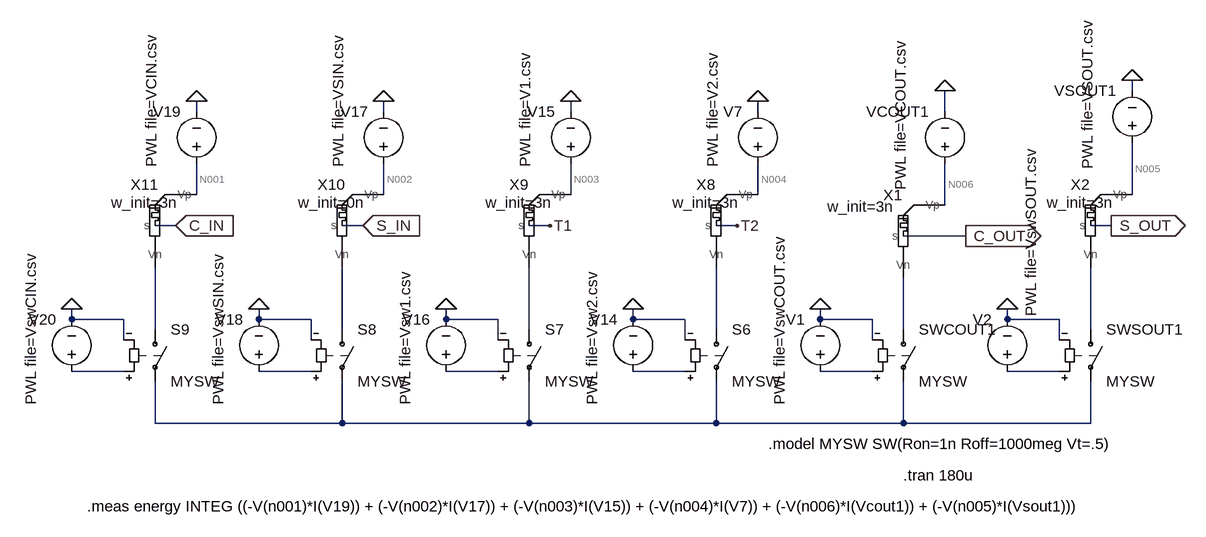
[diagram p0: schematic approx1_PPU.asc]
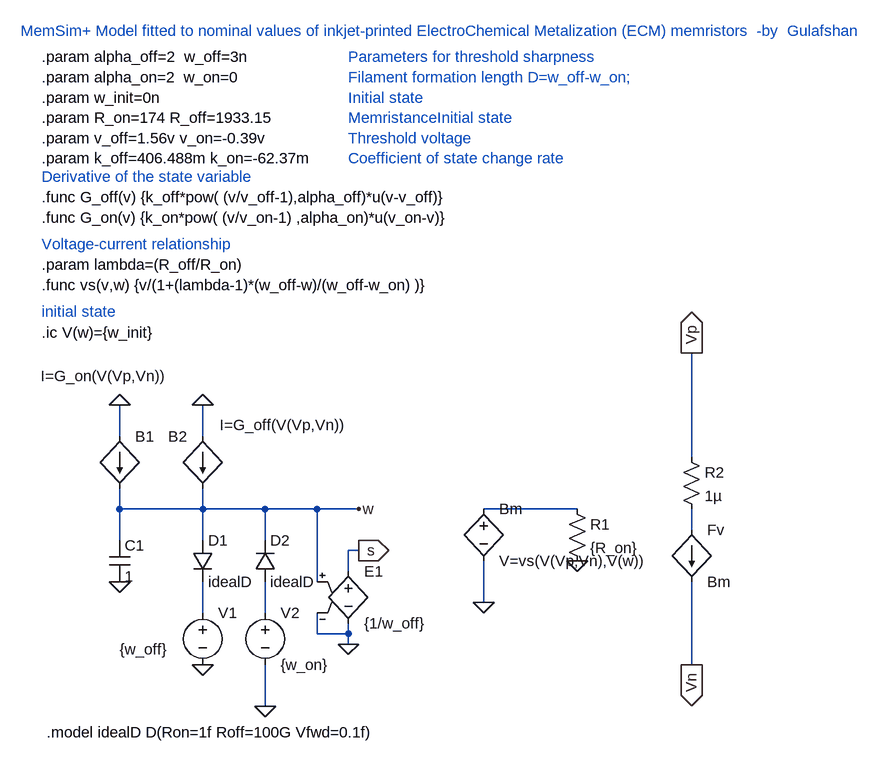
[diagram p1: sub-circuit memsim+ecm_nominal.asc]
approx1_PPU.asc, the LTspice schematic file:
Version 4
SHEET 1 3080 680
WIRE 336 -16 336 -32
WIRE -1104 16 -1104 0
WIRE -816 16 -816 0
WIRE -528 16 -528 0
WIRE -240 16 -240 0
WIRE 48 16 48 -16
WIRE -1104 144 -1104 96
WIRE -816 144 -816 96
WIRE -528 144 -528 96
WIRE -240 144 -240 96
WIRE 336 144 336 64
WIRE 48 160 48 96
WIRE -1136 192 -1168 192
WIRE -848 192 -880 192
WIRE -560 192 -592 192
WIRE -272 192 -304 192
WIRE 304 192 272 192
WIRE 80 208 -16 208
WIRE -1296 336 -1296 320
WIRE -1216 336 -1296 336
WIRE -1008 336 -1008 320
WIRE -928 336 -1008 336
WIRE -720 336 -720 320
WIRE -640 336 -720 336
WIRE -432 336 -432 320
WIRE -352 336 -432 336
WIRE -144 336 -144 320
WIRE -64 336 -144 336
WIRE 144 336 144 320
WIRE 224 336 144 336
WIRE -1168 352 -1168 256
WIRE -880 352 -880 256
WIRE -592 352 -592 256
WIRE -304 352 -304 256
WIRE -16 352 -16 272
WIRE 272 352 272 256
WIRE -1216 368 -1216 336
WIRE -928 368 -928 336
WIRE -640 368 -640 336
WIRE -352 368 -352 336
WIRE -64 368 -64 336
WIRE 224 368 224 336
WIRE -1216 416 -1296 416
WIRE -928 416 -1008 416
WIRE -640 416 -720 416
WIRE -352 416 -432 416
WIRE -64 416 -144 416
WIRE 224 416 144 416
WIRE -1168 496 -1168 432
WIRE -880 496 -880 432
WIRE -880 496 -1168 496
WIRE -592 496 -592 432
WIRE -592 496 -880 496
WIRE -304 496 -304 432
WIRE -304 496 -592 496
WIRE -16 496 -16 432
WIRE -16 496 -304 496
WIRE 272 496 272 432
WIRE 272 496 -16 496
FLAG -272 192 T2
FLAG -240 0 0
FLAG -432 320 0
FLAG -560 192 T1
FLAG -528 0 0
FLAG -720 320 0
FLAG -848 192 S_IN
IOPIN -848 192 In
FLAG -816 0 0
FLAG -1008 320 0
FLAG -1136 192 C_IN
IOPIN -1136 192 In
FLAG -1104 0 0
FLAG -1296 320 0
FLAG 48 -16 0
FLAG -144 320 0
FLAG 336 -32 0
FLAG 144 320 0
FLAG 304 192 S_OUT
IOPIN 304 192 Out
FLAG 80 208 C_OUT
IOPIN 80 208 Out
SYMBOL MemSim+ECM_Nominal -352 144 R0
WINDOW 39 32 28 Bottom 2
SYMATTR SpiceLine w_init=3n
SYMATTR InstName X8
SYMBOL voltage -240 112 R180
WINDOW 0 24 96 Left 2
WINDOW 3 70 10 VRight 2
WINDOW 123 0 0 Left 2
WINDOW 39 0 0 Left 2
SYMATTR InstName V7
SYMATTR Value PWL file=V2.csv
SYMBOL sw -304 336 R0
SYMATTR InstName S6
SYMATTR Value MYSW
SYMBOL voltage -432 432 R180
WINDOW 0 24 96 Left 2
WINDOW 3 63 -36 VRight 2
WINDOW 123 0 0 Left 2
WINDOW 39 0 0 Left 2
SYMATTR InstName V14
SYMATTR Value PWL file=Vsw2.csv
SYMBOL MemSim+ECM_Nominal -640 144 R0
WINDOW 39 32 28 Bottom 2
SYMATTR SpiceLine w_init=3n
SYMATTR InstName X9
SYMBOL voltage -528 112 R180
WINDOW 0 24 96 Left 2
WINDOW 3 70 10 VRight 2
WINDOW 123 0 0 Left 2
WINDOW 39 0 0 Left 2
SYMATTR InstName V15
SYMATTR Value PWL file=V1.csv
SYMBOL sw -592 336 R0
SYMATTR InstName S7
SYMATTR Value MYSW
SYMBOL voltage -720 432 R180
WINDOW 0 24 96 Left 2
WINDOW 3 63 -36 VRight 2
WINDOW 123 0 0 Left 2
WINDOW 39 0 0 Left 2
SYMATTR InstName V16
SYMATTR Value PWL file=Vsw1.csv
SYMBOL MemSim+ECM_Nominal -928 144 R0
WINDOW 39 32 28 Bottom 2
SYMATTR SpiceLine w_init=0n
SYMATTR InstName X10
SYMBOL voltage -816 112 R180
WINDOW 0 24 96 Left 2
WINDOW 3 70 10 VRight 2
WINDOW 123 0 0 Left 2
WINDOW 39 0 0 Left 2
SYMATTR InstName V17
SYMATTR Value PWL file=VSIN.csv
SYMBOL sw -880 336 R0
SYMATTR InstName S8
SYMATTR Value MYSW
SYMBOL voltage -1008 432 R180
WINDOW 0 24 96 Left 2
WINDOW 3 63 -36 VRight 2
WINDOW 123 0 0 Left 2
WINDOW 39 0 0 Left 2
SYMATTR InstName V18
SYMATTR Value PWL file=VswSIN.csv
SYMBOL MemSim+ECM_Nominal -1216 144 R0
WINDOW 39 32 28 Bottom 2
SYMATTR SpiceLine w_init=3n
SYMATTR InstName X11
SYMBOL voltage -1104 112 R180
WINDOW 0 24 96 Left 2
WINDOW 3 70 10 VRight 2
WINDOW 123 0 0 Left 2
WINDOW 39 0 0 Left 2
SYMATTR InstName V19
SYMATTR Value PWL file=VCIN.csv
SYMBOL sw -1168 336 R0
SYMATTR InstName S9
SYMATTR Value MYSW
SYMBOL voltage -1296 432 R180
WINDOW 0 24 96 Left 2
WINDOW 3 63 -36 VRight 2
WINDOW 123 0 0 Left 2
WINDOW 39 0 0 Left 2
SYMATTR InstName V20
SYMATTR Value PWL file=VswCIN.csv
SYMBOL MemSim+ECM_Nominal -64 160 R0
WINDOW 39 -18 18 Bottom 2
SYMATTR SpiceLine w_init=3n
SYMATTR InstName X1
SYMBOL sw -16 336 R0
SYMATTR InstName SWCOUT1
SYMATTR Value MYSW
SYMBOL voltage -144 432 R180
WINDOW 0 24 96 Left 2
WINDOW 3 63 -36 VRight 2
WINDOW 123 0 0 Left 2
WINDOW 39 0 0 Left 2
SYMATTR InstName V1
SYMATTR Value PWL file=VswCOUT.csv
SYMBOL MemSim+ECM_Nominal 224 144 R0
WINDOW 39 32 28 Bottom 2
SYMATTR SpiceLine w_init=3n
SYMATTR InstName X2
SYMBOL voltage 48 112 R180
WINDOW 0 24 96 Left 2
WINDOW 3 69 -25 VRight 2
WINDOW 123 0 0 Left 2
WINDOW 39 0 0 Left 2
SYMATTR InstName VCOUT1
SYMATTR Value PWL file=VCOUT.csv
SYMBOL sw 272 336 R0
SYMATTR InstName SWSOUT1
SYMATTR Value MYSW
SYMBOL voltage 144 432 R180
WINDOW 0 24 96 Left 2
WINDOW 3 -36 100 VRight 2
WINDOW 123 0 0 Left 2
WINDOW 39 0 0 Left 2
SYMATTR InstName V2
SYMATTR Value PWL file=VswSOUT.csv
SYMBOL voltage 336 80 R180
WINDOW 0 24 96 Left 2
WINDOW 3 69 -25 VRight 2
WINDOW 123 0 0 Left 2
WINDOW 39 0 0 Left 2
SYMATTR InstName VSOUT1
SYMATTR Value PWL file=VSOUT.csv
TEXT -16 576 Left 2 !.tran 180u
TEXT -224 528 Left 2 !.model MYSW SW(Ron=1n Roff=1000meg Vt=.5)
TEXT -1272 624 Left 2 !.meas energy INTEG ((-V(n001)*I(V19)) + (-V(n002)*I(V17)) + (-V(n003)*I(V15)) + (-V(n004)*I(V7)) + (-V(n006)*I(Vcout1)) + (-V(n005)*I(Vsout1)))

memsim+ecm_nominal.asc, the sub-circuit schematic file:
Version 4
SHEET 1 3964 1792
WIRE 160 400 160 352
WIRE 288 400 288 352
WIRE 1040 432 1040 272
WIRE 160 512 160 480
WIRE 288 512 288 480
WIRE 288 512 160 512
WIRE 384 512 288 512
WIRE 464 512 384 512
WIRE 528 512 464 512
WIRE 864 512 720 512
WIRE 1040 544 1040 512
WIRE 160 560 160 512
WIRE 288 560 288 512
WIRE 384 560 384 512
WIRE 528 576 512 576
WIRE 512 608 512 576
WIRE 464 624 464 512
WIRE 720 656 720 592
WIRE 288 672 288 624
WIRE 384 672 384 624
WIRE 464 704 464 672
WIRE 512 704 512 688
WIRE 512 704 464 704
WIRE 512 720 512 704
WIRE 1040 752 1040 624
WIRE 384 816 384 752
FLAG 160 352 0
FLAG 288 352 0
FLAG 160 624 0
FLAG 288 752 0
FLAG 528 512 w
FLAG 720 656 0
FLAG 864 592 0
FLAG 512 720 0
FLAG 528 576 s
IOPIN 528 576 Out
FLAG 1040 272 Vp
IOPIN 1040 272 Out
FLAG 1040 752 Vn
IOPIN 1040 752 Out
FLAG 384 816 0
SYMBOL bi 160 400 R0
WINDOW 3 -121 -93 Left 2
SYMATTR Value I=G_on(V(Vp,Vn))
SYMATTR InstName B1
SYMBOL bi 288 400 M0
WINDOW 3 -220 -17 Left 2
SYMATTR Value I=G_off(V(Vp,Vn))
SYMATTR InstName B2
SYMBOL cap 144 560 R0
SYMATTR InstName C1
SYMATTR Value 1
SYMBOL diode 272 560 R0
SYMATTR InstName D1
SYMATTR Value idealD
SYMBOL diode 368 624 M180
WINDOW 0 24 64 Left 2
WINDOW 3 24 0 Left 2
SYMATTR InstName D2
SYMATTR Value idealD
SYMBOL voltage 288 656 R0
WINDOW 123 0 0 Left 2
WINDOW 39 0 0 Left 2
WINDOW 3 -128 72 Left 2
SYMATTR Value {w_off}
SYMATTR InstName V1
SYMBOL res 848 496 R0
SYMATTR InstName R1
SYMATTR Value {R_on}
SYMBOL f 1040 544 R0
SYMATTR InstName Fv
SYMATTR Value Bm
SYMATTR Value2 -1
SYMBOL bv 720 496 R0
SYMATTR InstName Bm
SYMATTR Value V=vs(V(Vp,Vn),V(w))
SYMBOL e 512 592 R0
SYMATTR InstName E1
SYMATTR Value {1/w_off}
SYMBOL res 1024 416 R0
SYMATTR InstName R2
SYMATTR Value 1µ
SYMBOL voltage 384 656 R0
WINDOW 123 0 0 Left 0
WINDOW 39 0 0 Left 0
SYMATTR InstName V2
SYMATTR Value {w_on}
TEXT 8 -224 Left 2 ;MemSim+ Model fitted to nominal values of inkjet-printed ElectroChemical Metalization (ECM) memristors  -by  Gulafshan
TEXT 40 240 Left 2 !.ic V(w)={w_init}
TEXT 40 0 Left 2 ;Derivative of the state variable
TEXT 40 104 Left 2 ;Voltage-current relationship
TEXT 40 208 Left 2 ;initial state
TEXT 48 856 Left 2 !.model idealD D(Ron=1f Roff=100G Vfwd=0.1f)
TEXT 40 -184 Left 2 !.param alpha_off=2  w_off=3n\n.param alpha_on=2  w_on=0\n.param w_init=0n\n.param R_on=174 R_off=1933.15\n.param v_off=1.56v v_on=-0.39v\n.param k_off=406.488m k_on=-62.37m
TEXT 40 32 Left 2 !.func G_off(v) {k_off*pow( (v/v_off-1),alpha_off)*u(v-v_off)}\n.func G_on(v) {k_on*pow( (v/v_on-1) ,alpha_on)*u(v_on-v)}
TEXT 40 136 Left 2 !.param lambda=(R_off/R_on)\n.func vs(v,w) {v/(1+(lambda-1)*(w_off-w)/(w_off-w_on) )}
TEXT 512 -184 Left 2 ;Parameters for threshold sharpness\nFilament formation length D=w_off-w_on;\nInitial state \nMemristanceInitial state\nThreshold voltage\nCoefficient of state change rate

The netlist it stands for:
* approx1_PPU.asc
XX8 T2 N004 N010 memsim+ecm_nominal params: w_init=3n
V7 N004 0 PWL file=V2.csv
S6 N010 N019 N016 0 MYSW
V14 N016 0 PWL file=Vsw2.csv
XX9 T1 N003 N009 memsim+ecm_nominal params: w_init=3n
V15 N003 0 PWL file=V1.csv
S7 N009 N019 N015 0 MYSW
V16 N015 0 PWL file=Vsw1.csv
XX10 S_IN N002 N008 memsim+ecm_nominal params: w_init=0n
V17 N002 0 PWL file=VSIN.csv
S8 N008 N019 N014 0 MYSW
V18 N014 0 PWL file=VswSIN.csv
XX11 C_IN N001 N007 memsim+ecm_nominal params: w_init=3n
V19 N001 0 PWL file=VCIN.csv
S9 N007 N019 N013 0 MYSW
V20 N013 0 PWL file=VswCIN.csv
XX1 C_OUT N006 N011 memsim+ecm_nominal params: w_init=3n
SWCOUT1 N011 N019 N017 0 MYSW
V1 N017 0 PWL file=VswCOUT.csv
XX2 S_OUT N005 N012 memsim+ecm_nominal params: w_init=3n
VCOUT1 N006 0 PWL file=VCOUT.csv
SWSOUT1 N012 N019 N018 0 MYSW
V2 N018 0 PWL file=VswSOUT.csv
VSOUT1 N005 0 PWL file=VSOUT.csv

* block symbol definitions
.subckt memsim+ecm_nominal s Vp Vn
B1 0 w I=G_on(V(Vp,Vn))
B2 0 w I=G_off(V(Vp,Vn))
C1 w 0 1
D1 w N003 idealD
D2 N004 w idealD
V1 N003 0 {w_off}
R1 N001 0 {R_on}
Fv N002 Vn Bm -1
Bm N001 0 V=vs(V(Vp,Vn),V(w))
E1 s 0 w 0 {1/w_off}
R2 Vp N002 1µ
V2 N004 0 {w_on}
* MemSim+ Model fitted to nominal values of inkjet-printed ElectroChemical Metalization (ECM) memristors  -by  Gulafshan
.ic V(w)={w_init}
* Derivative of the state variable
* Voltage-current relationship
* initial state
.model idealD D(Ron=1f Roff=100G Vfwd=0.1f)
.param alpha_off=2  w_off=3n
.param alpha_on=2  w_on=0
.param w_init=0n
.param R_on=174 R_off=1933.15
.param v_off=1.56v v_on=-0.39v
.param k_off=406.488m k_on=-62.37m
.func G_off(v) {k_off*pow( (v/v_off-1),alpha_off)*u(v-v_off)}
.func G_on(v) {k_on*pow( (v/v_on-1) ,alpha_on)*u(v_on-v)}
.param lambda=(R_off/R_on)
.func vs(v,w) {v/(1+(lambda-1)*(w_off-w)/(w_off-w_on) )}
* Parameters for threshold sharpness
* Filament formation length D=w_off-w_on;
* Initial state
* MemristanceInitial state
* Threshold voltage
* Coefficient of state change rate
.ends memsim+ecm_nominal

.model D D
.lib standard.dio
.tran 180u
.model MYSW SW(Ron=1n Roff=1000meg Vt=.5)
.meas energy INTEG ((-V(n001)*I(V19)) + (-V(n002)*I(V17)) + (-V(n003)*I(V15)) + (-V(n004)*I(V7)) + (-V(n006)*I(Vcout1)) + (-V(n005)*I(Vsout1)))
.backanno
.end